# Altium project iMag1_0.PrjPcb
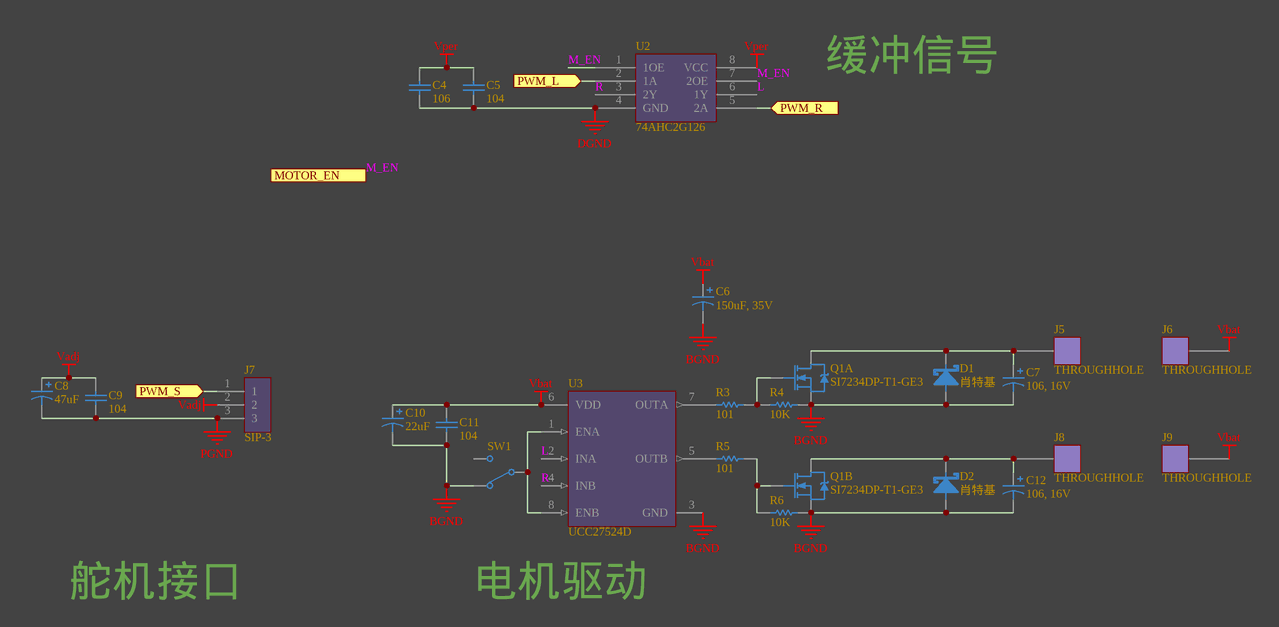
[diagram p0: driver.SchDoc]
嘉立创: TRUE; 雕刻机: FALSE
3 sheets, 75 parts. Net scope: hierarchical (ports join the sheet entries above them; power ports are global).
Board file: jlc.PcbDoc
Sheets:
  driver.SchDoc
  power.SchDoc
  analog.SchDoc

## Sheet driver.SchDoc
size A4; DocumentNumber: 2; SheetNumber: 3

### Parts
C4  106  [C0603]
C5  104  [C0402]
C6  150uF, 35V  [贴片电解 10*10.5]
C7  106, 16V  [贴片电解 6.3*5.4]
C8  47uF  [贴片电解 6.3*5.4]
C9  104  [C0402]
C10  22uF  [贴片电解 4*5.4]
C11  104  [C0402]
C12  106, 16V  [贴片电解 6.3*5.4]
D1  肖特基  [SOD-123F]
D2  肖特基  [SOD-123F]
J5  THROUGHHOLE  [MOTOR]
J6  THROUGHHOLE  [MOTOR]
J7  SIP-3  [2.54排针1X3]
J8  THROUGHHOLE  [MOTOR]
J9  THROUGHHOLE  [MOTOR]
Q1  SI7234DP-T1-GE3  [DFN-8EP2]  (parts A,B of 2)
R3  101  [R0603]
R4  10K  [R0402]
R5  101  [R0603]
R6  10K  [R0402]
SW1  K3-1235S-K1  [K3-1235S-K1]  (value not drawn)
U2  74AHC2G126  [VSSOP-8]
U3  UCC27524D  [TSSOP-8EP]

### Ports
MOTOR_EN (in), PWM_L (in), PWM_R (in), PWM_S (in)

### Nets
BGND: C6.2 C7.2 C10.2 C11.1 C12.2 D1.1(A) D2.1(A) Q1.1(S) Q1.3(S) R4.1 R6.1 SW1.1 U3.3(GND)
DGND: C4.1 C5.1 U2.4(GND)
PGND: C8.2 C9.1 J7.3
Vadj: C8.1 C9.2 J7.2
Vbat: C6.1 C10.1 C11.2 J6.1 J9.1 U3.6(VDD)
Vper: C4.2 C5.2 U2.8(VCC)
L: U2.6(1Y) U3.2(INA)
M_EN: U2.1(1OE) U2.7(2OE) ; port MOTOR_EN
R: U2.3(2Y) U3.4(INB)
NetC7_1: C7.1 D1.2(K) J5.1 Q1.6(D)
NetC12_1: C12.1 D2.2(K) J8.1 Q1.5(D)
NetJ7_1: J7.1 ; port PWM_S
NetQ1_2: Q1.2(G) R3.1 R4.2
NetQ1_4: Q1.4(G) R5.1 R6.2
NetR3_2: R3.2 U3.7(OUTA)
NetR5_2: R5.2 U3.5(OUTB)
NetSW1_2: SW1.2 U3.1(ENA) U3.8(ENB)
NetU2_2: U2.2(1A) ; port PWM_L
NetU2_5: U2.5(2A) ; port PWM_R

Not connected (* = marked no-connect by the designer): SW1 3

### Notes on the sheet
- 缓冲信号
- 舵机接口
- 电机驱动

### Library data of the parts
C4 C5 C9 C11 = 电容: Capacitor; Value: 22pF; Published: 8-Jun-2000; LatestRevisionDate: 17-Jul-2002; LatestRevisionNote: Re-released for DXP Platform.; PackageReference: RAD-0.3; Publisher: Altium Limited; PackageDescription: Radial Cap, Thru-Hole; 2 Leads; 0.3 in Pin Spacing
C6-C8 C10 C12 = 电解电容: Polarized Capacitor (Axial); Value: 100pF; Published: 8-Jun-2000; LatestRevisionDate: 17-Jul-2002; LatestRevisionNote: Re-released for DXP Platform.; PackageReference: POLAR0.8; Publisher: Altium Limited; PackageDescription: Polarized Capacitor; 2 Leads
D1 D2 = 肖特基: Schottky Diode
J5 J6 J8 J9 = MOTOR
Q1 = N沟道MOSFET: CQ-BS170
R3-R6 = 电阻: Resistor; Value: 150R; Published: 8-Jun-2000; LatestRevisionDate: 17-Jul-2002; LatestRevisionNote: Re-released for DXP Platform.; PackageReference: AXIAL-0.3; Publisher: Altium Limited; PackageDescription: Axial Device, Thru-Hole; 2 Leads; 0.3 in Pin Spacing
SW1 = 单刀双掷: Switch
U2 = 74126
U3 = UCC27524D: No Description Available; PartNumber: UCC27524DR; Manufacturer: Texas Instruments; RefDes: RefDes; Type: DEV; Value: Value; Copyright: Copyright (C) 2018 Accelerated Designs. All rights reserved

## Sheet power.SchDoc
size A4; DocumentNumber: 3; SheetNumber: 5
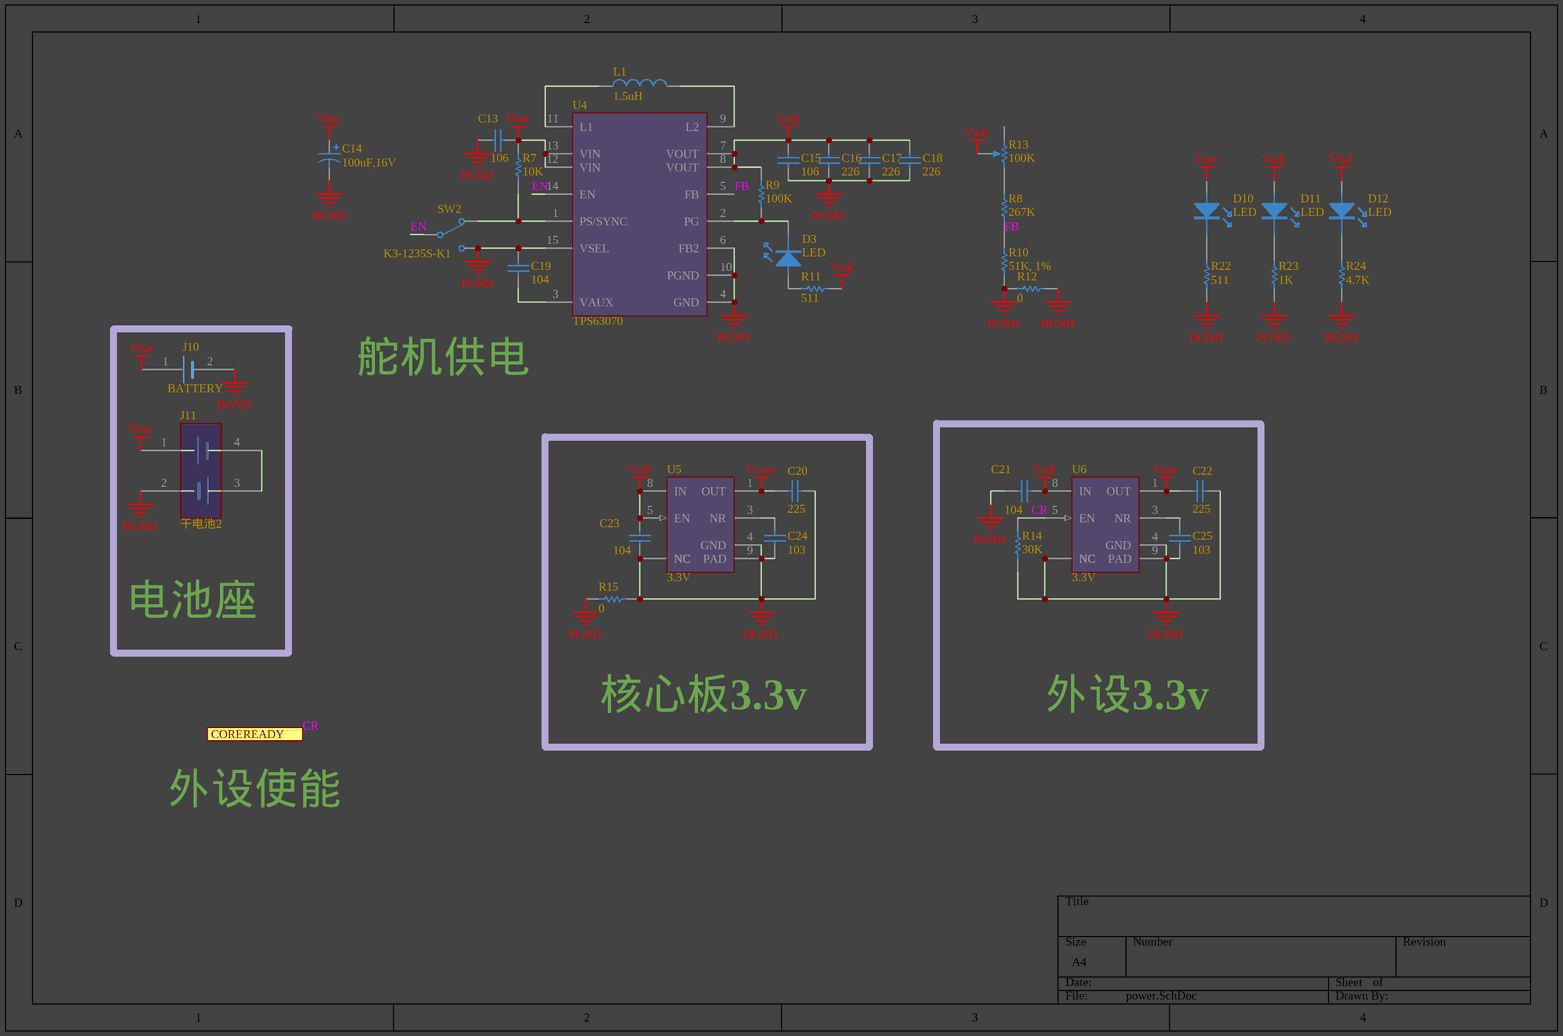
[diagram p1: power.SchDoc]

### Parts
C13  106  [C0603]
C14  100uF,16V  [贴片电解 6.3*5.4]
C15  106  [C0603]
C16  226  [0805C]
C17  226  [0805C]
C18  226  [0805C]
C19  104  [C0402]
C20  225  [C0603]
C21  104  [C0402]
C22  225  [C0603]
C23  104  [C0402]
C24  103  [C0402]
C25  103  [C0402]
D3  LED  [LED 0603R]
D10  LED  [LED 0603Y]
D11  LED  [LED 0603G]
D12  LED  [LED 0603B]
J10  BATTERY  [T接头]
J11  干电池2  [18650x2]
L1  1.5uH  [L5X5]
R7  10K  [R0402]
R8  267K  [R0402]
R9  100K  [R0402]
R10  51K, 1%  [R0402]
R11  511  [R0402]
R12  0  [R0603]
R13  100K  [3296W]
R14  30K  [R0402]
R15  0  [R0603]
R22  511  [R0402]
R23  1K  [R0402]
R24  4.7K  [R0402]
SW2  K3-1235S-K1  [K3-1235S-K1]
U4  TPS63070  [VQFN-15]
U5  3.3V  [VSON-8]
U6  3.3V  [VSON-8]

### Blocks framed on the sheet
电池座: J10 J11
核心板3.3v: C20 C23 C24 R15 U5
外设3.3v: C21 C22 C25 R14 U6

### Ports
COREREADY (in)

### Nets
BGND: C14.2 J10.2(+) J11.2(+) R12.1 R24.1
DGND: C20.2 C22.2 C23.1 C24.1 C25.1 R14.2 R15.1 R22.1 U5.2(NC) U5.4(GND) U5.6(NC) U5.7(NC) U5.9(PAD) U6.2(NC) U6.4(GND) U6.6(NC) U6.7(NC) U6.9(PAD)
PGND: C13.2 C15.1 C16.1 C17.1 C18.1 C19.2 C21.2 R10.2 R12.2 R15.2 R23.1 SW2.3 U4.4(GND) U4.6(FB2) U4.10(PGND) U4.15(VSEL)
Vadj: C15.2 C16.2 C17.2 C18.2 C21.1 C23.2 D11.A R9.2 R11.1 R13.2(TAP) U4.7(VOUT) U4.8(VOUT) U5.5(EN) U5.8(IN) U6.8(IN)
Vbat: C13.1 C14.1 D12.A J10.1(+) J11.1(+) R7.2 U4.12(VIN) U4.13(VIN)
Vcore: C20.1 U5.1(OUT)
Vper: C22.1 D10.A U6.1(OUT)
CR: R14.1 U6.5(EN) ; port COREREADY
EN: SW2.2 U4.14(EN)
FB: R8.2 R10.1 U4.5(FB)
NetC19_1: C19.1 U4.3(VAUX)
NetC24_2: C24.2 U5.3(NR)
NetC25_2: C25.2 U6.3(NR)
NetD3_A: D3.A R11.2
NetD3_K: D3.K R9.1 U4.2(PG)
NetD10_K: D10.K R22.2
NetD11_K: D11.K R23.2
NetD12_K: D12.K R24.2
NetJ11_3: J11.3(+) J11.4(+)
NetL1_1: L1.1 U4.11(L1)
NetL1_2: L1.2 U4.9(L2)
NetR7_1: R7.1 SW2.1 U4.1(PS/SYNC)
NetR8_1: R8.1 R13.3(BOT)

Not connected (* = marked no-connect by the designer): R13 1(TOP)

### Notes on the sheet
- 舵机供电
- 外设使能

### Library data of the parts
C13 C15-C19 C21 C23-C25 = 电容: Capacitor; Value: 22pF; Published: 8-Jun-2000; LatestRevisionDate: 17-Jul-2002; LatestRevisionNote: Re-released for DXP Platform.; PackageReference: RAD-0.3; Publisher: Altium Limited; PackageDescription: Radial Cap, Thru-Hole; 2 Leads; 0.3 in Pin Spacing
C14 = 电解电容: as C6 on sheet driver; Published: 8-Jun-2000; LatestRevisionDate: 17-Jul-2002; LatestRevisionNote: Re-released for DXP Platform.; PackageReference: POLAR0.8; Publisher: Altium Limited; PackageDescription: Polarized Capacitor; 2 Leads
C20 C22 = 电容: X5R Capacitor; Value: 22pF; Published: 8-Jun-2000; LatestRevisionDate: 17-Jul-2002; LatestRevisionNote: Re-released for DXP Platform.; PackageReference: RAD-0.3; Publisher: Altium Limited; PackageDescription: Radial Cap, Thru-Hole; 2 Leads; 0.3 in Pin Spacing
L1 = 贴片电感: 4.6A, 14.4mOhm
R7-R12 R14 R15 R22-R24 = 电阻: Resistor; Value: 150R; Published: 8-Jun-2000; LatestRevisionDate: 17-Jul-2002; LatestRevisionNote: Re-released for DXP Platform.; PackageReference: AXIAL-0.3; Publisher: Altium Limited; PackageDescription: Axial Device, Thru-Hole; 2 Leads; 0.3 in Pin Spacing
R13 = 电位器
SW2 = 单刀双掷: Switch
U5 U6 = TPS73512DRBR: No Description Available; Alternate_PartNumber: TPS73512DRBT; Manufacturer: Texas Instruments; CompType: IC; PIN_COUNT: 9; Application_BuildNumber: *; PartNumber: TPS73512DRBR; PackageReference: DRB0008A; MountType: SMT; RoHS: Y; RefDes: RefDes; Type: DEV; Value: Value; Copyright: Copyright (C) 2018 Accelerated Designs. All rights reserved

## Sheet analog.SchDoc
size A4; DocumentNumber: 4; SheetNumber: 2
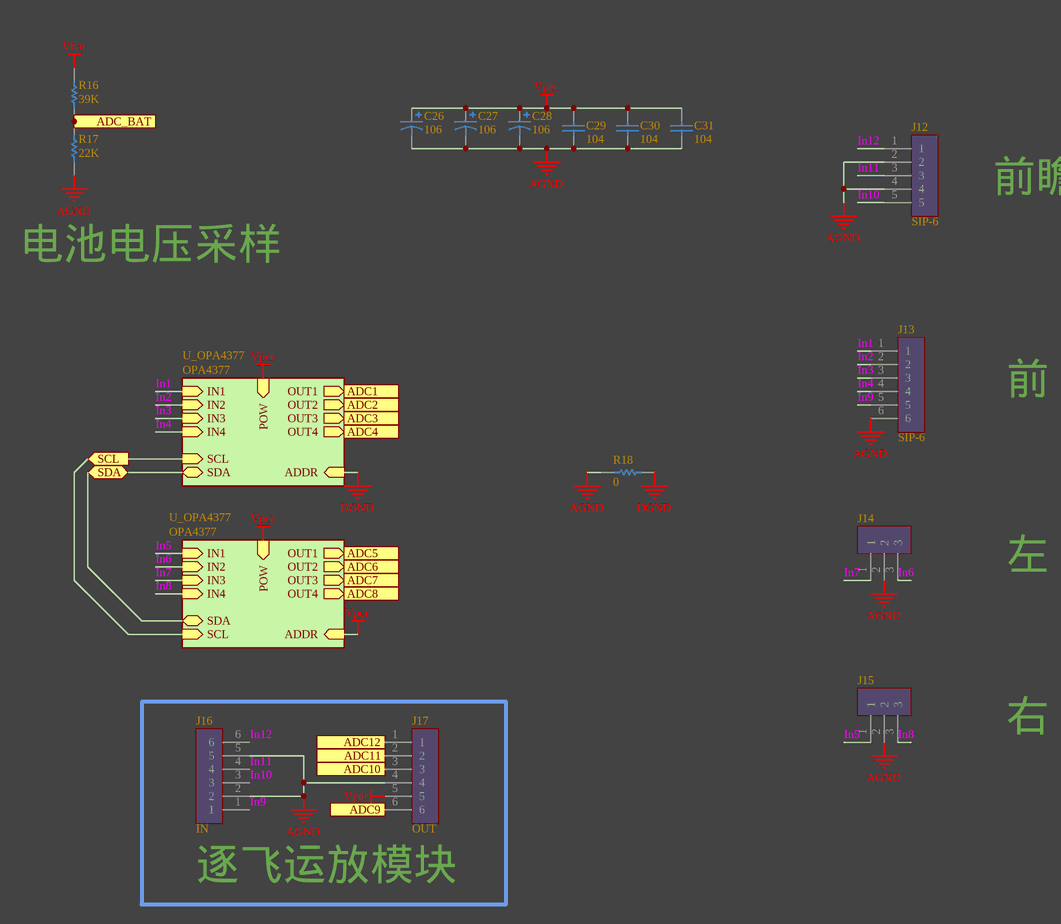
[diagram p2: analog.SchDoc]

### Parts
C26  106  [3216-ce]
C27  106  [3216-ce]
C28  106  [3216-ce]
C29  104  [C0402]
C30  104  [C0402]
C31  104  [C0402]
J12  SIP-6  [2.54排针1X5]
J13  SIP-6  [2.54简易牛角座6P]
J14  SIP-3  [XH2.54-3SMD]  (value not drawn)
J15  SIP-3  [XH2.54-3SMD]  (value not drawn)
J16  IN  [2.54排针1X6]
J17  OUT  [2.54排针1X6]
R16  39K  [R0402]
R17  22K  [R0402]
R18  0  [R0603]

### Blocks framed on the sheet
逐飞运放模块: J16 J17

### Sub-sheets
U_OPA4377 = OPA4377 (file not in this document): IN1 (in), IN2 (in), IN3 (in), IN4 (in), OUT1 (out), OUT2 (out), OUT3 (out), OUT4 (out), POW (in), ADDR (in), SDA (bidir), SCL (in)
U_OPA4377 = OPA4377 (file not in this document): IN1 (in), IN2 (in), IN3 (in), IN4 (in), OUT1 (out), OUT2 (out), OUT3 (out), OUT4 (out), POW (in), ADDR (in), SDA (bidir), SCL (in)

### Ports
ADC1 (out), ADC2 (out), ADC3 (out), ADC4 (out), ADC5 (out), ADC6 (out), ADC7 (out), ADC8 (out), ADC9 (out), ADC10 (out), ADC11 (out), ADC12 (out), ADC_BAT (out), SCL (in), SDA (bidir)

### Nets
AGND: C26.2 C27.2 C28.2 C29.1 C30.1 C31.1 J12.2 J12.4 J13.6 J14.2 J15.2 J16.2 J16.5 J17.4 R17.1 R18.2
DGND: R18.1 ; sheet U_OPA4377/ADDR
Vbat: R16.2
Vper: C26.1 C27.1 C28.1 C29.2 C30.2 C31.2 J17.5 ; sheet U_OPA4377/POW, sheet U_OPA4377/POW, sheet U_OPA4377/ADDR
In1: J13.1 ; sheet U_OPA4377/IN1
In2: J13.2 ; sheet U_OPA4377/IN2
In3: J13.3 ; sheet U_OPA4377/IN3
In4: J13.4 ; sheet U_OPA4377/IN4
In5: J15.1 ; sheet U_OPA4377/IN1
In6: J14.3 ; sheet U_OPA4377/IN2
In7: J14.1 ; sheet U_OPA4377/IN3
In8: J15.3 ; sheet U_OPA4377/IN4
In9: J13.5 J16.1
In10: J12.5 J16.3
In11: J12.3 J16.4
In12: J12.1 J16.6
NetJ17_1: J17.1 ; port ADC12
NetJ17_2: J17.2 ; port ADC11
NetJ17_3: J17.3 ; port ADC10
NetJ17_6: J17.6 ; port ADC9
NetR16_1: R16.1 R17.2 ; port ADC_BAT
(unnamed): port ADC1, sheet U_OPA4377/OUT1
(unnamed): port ADC2, sheet U_OPA4377/OUT2
(unnamed): port ADC3, sheet U_OPA4377/OUT3
(unnamed): port ADC4, sheet U_OPA4377/OUT4
(unnamed): port ADC5, sheet U_OPA4377/OUT1
(unnamed): port ADC6, sheet U_OPA4377/OUT2
(unnamed): port ADC7, sheet U_OPA4377/OUT3
(unnamed): port ADC8, sheet U_OPA4377/OUT4
(unnamed): port SCL, sheet U_OPA4377/SCL, sheet U_OPA4377/SCL
(unnamed): port SDA, sheet U_OPA4377/SDA, sheet U_OPA4377/SDA

### Notes on the sheet
- 前瞻
- 电池电压采样
- 前
- 左
- 右

### Library data of the parts
C26-C28 = 电解电容: as C6 on sheet driver; Published: 8-Jun-2000; LatestRevisionDate: 17-Jul-2002; LatestRevisionNote: Re-released for DXP Platform.; PackageReference: POLAR0.8; Publisher: Altium Limited; PackageDescription: Polarized Capacitor; 2 Leads
C29-C31 = 电容: Capacitor; Value: 22pF; Published: 8-Jun-2000; LatestRevisionDate: 17-Jul-2002; LatestRevisionNote: Re-released for DXP Platform.; PackageReference: RAD-0.3; Publisher: Altium Limited; PackageDescription: Radial Cap, Thru-Hole; 2 Leads; 0.3 in Pin Spacing
J12 = SIP-5
J16 J17 = SIP-6
R16-R18 = 电阻: Resistor; Value: 150R; Published: 8-Jun-2000; LatestRevisionDate: 17-Jul-2002; LatestRevisionNote: Re-released for DXP Platform.; PackageReference: AXIAL-0.3; Publisher: Altium Limited; PackageDescription: Axial Device, Thru-Hole; 2 Leads; 0.3 in Pin Spacing

## Nets that join several sheets
BGND: driver (13 pins), power (5 pins)
DGND: driver (C4.1 C5.1 U2.4), power (18 pins), analog (R18.1)
PGND: driver (C8.2 C9.1 J7.3), power (16 pins)
Vadj: driver (C8.1 C9.2 J7.2), power (15 pins)
Vbat: driver (6 pins), power (8 pins), analog (R16.2)
Vper: driver (C4.2 C5.2 U2.8), power (C22.1 D10.A U6.1), analog (7 pins)